# Altium schematic sheet SH08 - OMAP-L137 EMIF A.SchDoc
size 386 x 246 mm
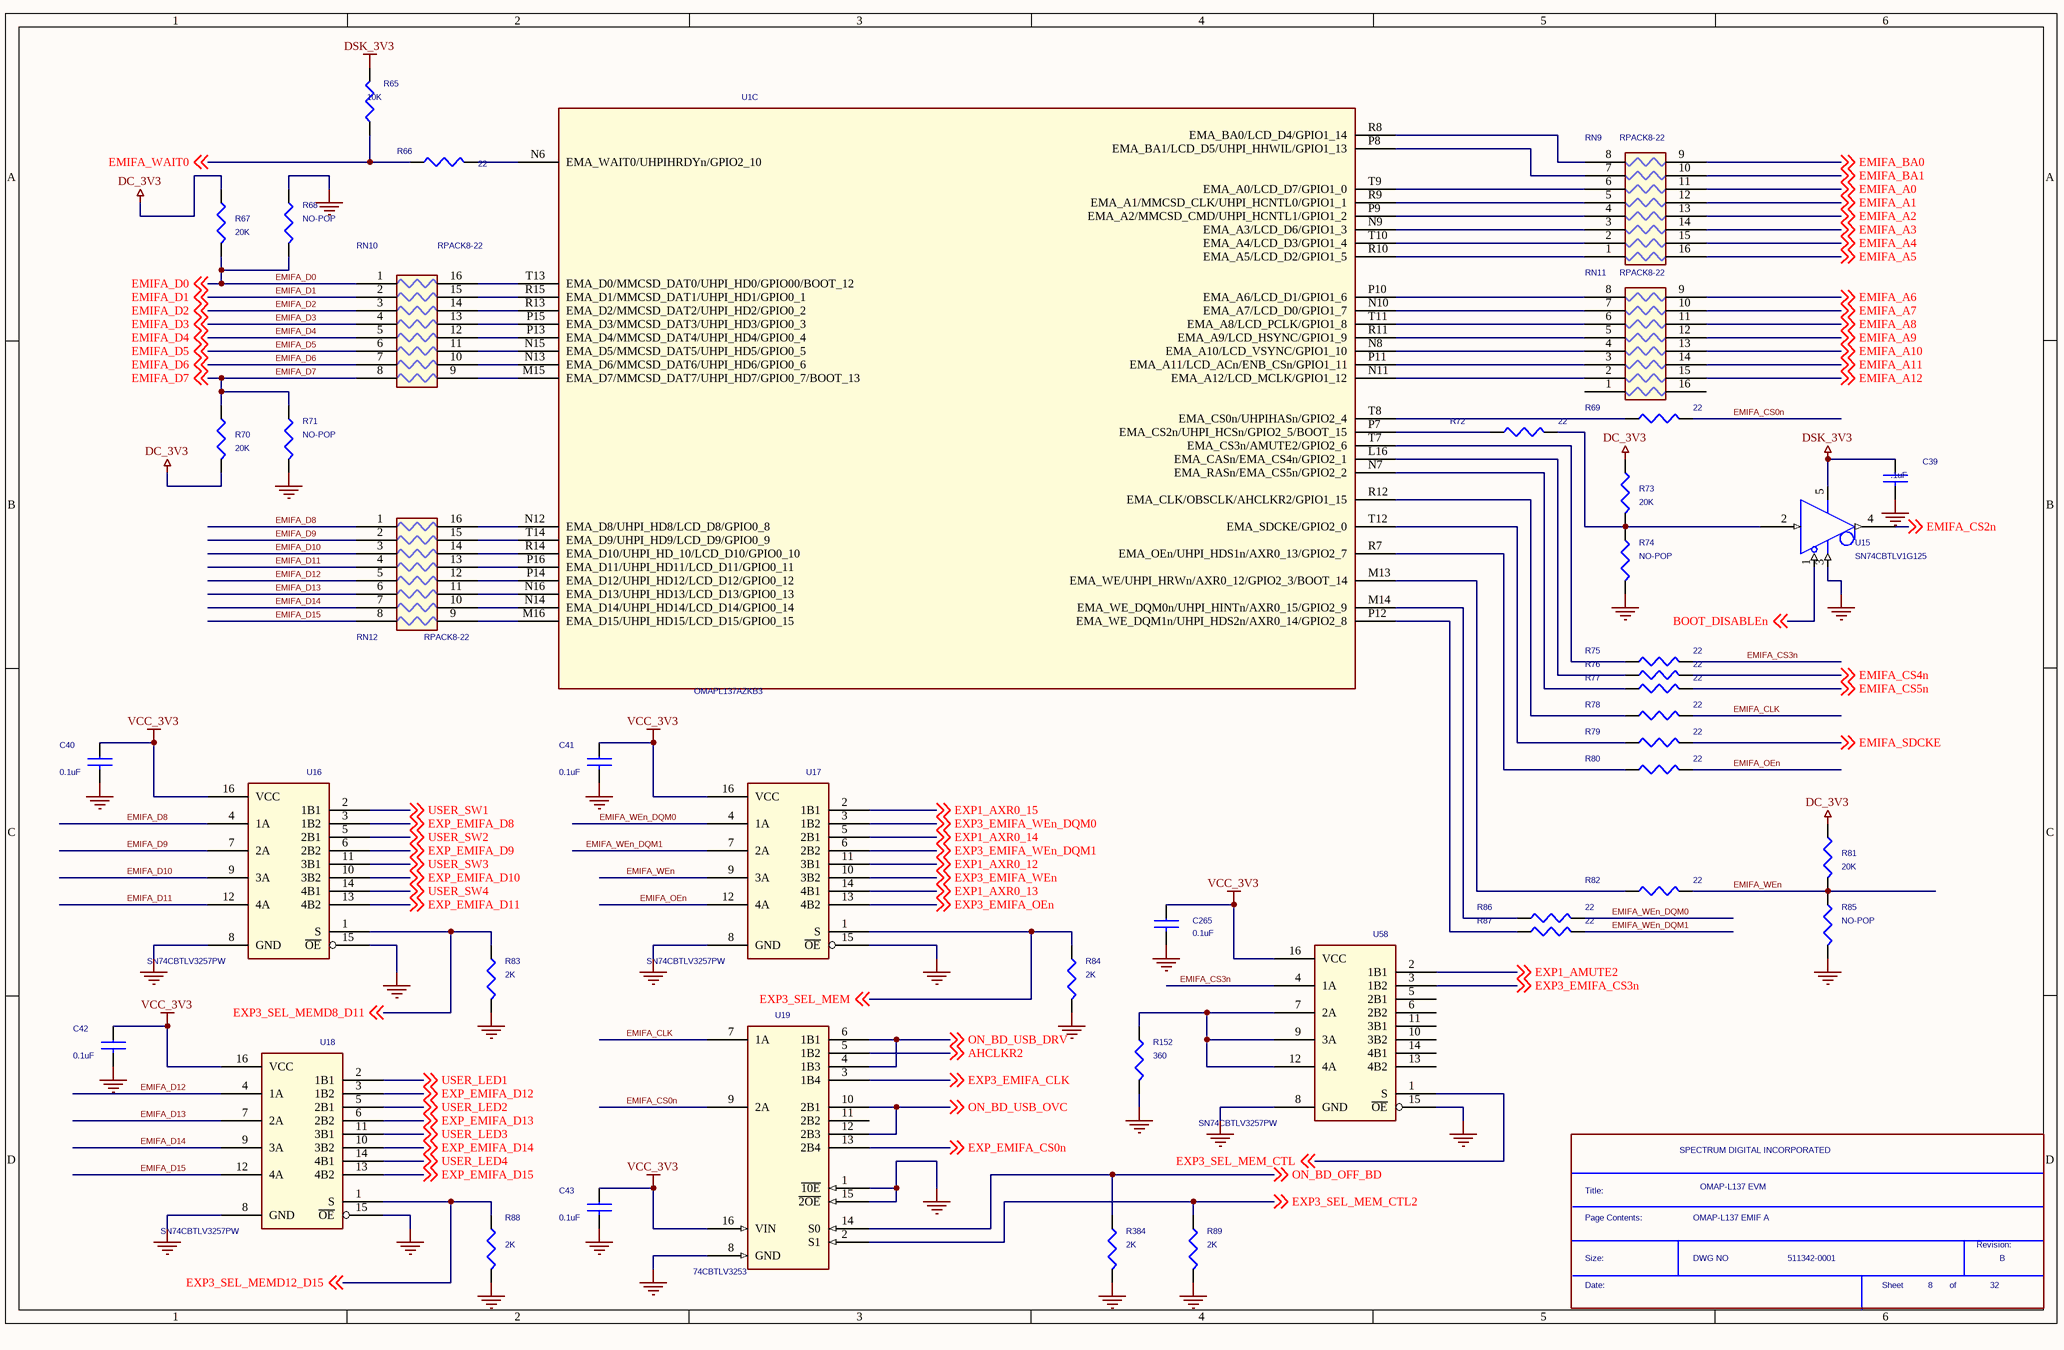
[diagram p0: SH08 - OMAP-L137 EMIF A.SchDoc]

## Parts
*  Page Contents:: OMAP-L137 EMIF A  RevCode: B  Title: OMAP-L137 EVM  OrgName: SPECTRUM DIGITAL INCORPORATED  Doc: 511342-0001  Page Number: 8  Page Count: 32  (hidden comment: SDTitleBlock)  (graphical)
C39  .1uF  [c402-25]
C40  0.1uF  [c402-25]
C41  0.1uF  [c402-25]
C42  0.1uF  [c402-25]
C43  0.1uF  [c402-25]
C265  0.1uF  [c402-25]
R65  10K  [r402-25]
R66  22  [r402-25]
R67  20K  [r402-25]
R68  NO-POP  [r402-25]
R69  22  [r402-25]
R70  20K  [r402-25]
R71  NO-POP  [r402-25]
R72  22  [r402-25]
R73  20K  [r402-25]
R74  NO-POP  [r402-25]
R75  22  [r402-25]
R76  22  [r402-25]
R77  22  [r402-25]
R78  22  [r402-25]
R79  22  [r402-25]
R80  22  [r402-25]
R81  20K  [r402-25]
R82  22  [r402-25]
R83  2K  [r402-25]
R84  2K  [r402-25]
R85  NO-POP  [r402-25]
R86  22  [r402-25]
R87  22  [r402-25]
R88  2K  [r402-25]
R89  2K  [r402-25]
R152  360  [r402-25]
R384  2K  [r402-25]
RN9  RPACK8-22  [rpak16-10x25-2hv]
RN10  RPACK8-22  [rpak16-10x25-2hv]
RN11  RPACK8-22  [rpak16-10x25-2hv]
RN12  RPACK8-22  [rpak16-10x25-2hv]
U1  OMAPL137AZKB3  [skt256-6064]  (part C of 9)
U15  SN74CBTLV1G125  [DCK]
U16  SN74CBTLV3257PW  [TSSOP-16]
U17  SN74CBTLV3257PW  [TSSOP-16]
U18  SN74CBTLV3257PW  [TSSOP-16]
U19  74CBTLV3253  [tssop16-14x70]
U58  SN74CBTLV3257PW  [TSSOP-16]

## Nets
DC_3V3: R67.1 R70.2 R73.1 R81.1
DSK_3V3: C39.1 R65.1 U15.5(VCC)
GND: C39.2 C40.2 C41.2 C42.2 C43.2 C265.2 R68.1 R71.2 R74.2 R83.2 R84.2 R85.2 R88.2 R89.2 R152.2 R384.2 U15.3(GND) U16.8(GND) U16.15(~{OE}) U17.8(GND) U17.15(~{OE}) U18.8(GND) U18.15(~{OE}) U19.1(~{10E}) U19.8(GND) U19.15(~{2OE}) U58.8(GND) U58.15(~{OE})
VCC_3V3: C40.1 C41.1 C42.1 C43.1 C265.1 U16.16(VCC) U17.16(VCC) U18.16(VCC) U19.16(VIN) U58.16(VCC)
AHCLKR2: U19.5(1B2) ; off-sheet AHCLKR2
BOOT_DISABLEn: U15.1(OE) ; off-sheet BOOT_DISABLEn
EMIFA_A0: RN9.11 ; off-sheet EMIFA_A0
EMIFA_A1: RN9.12 ; off-sheet EMIFA_A1
EMIFA_A2: RN9.13 ; off-sheet EMIFA_A2
EMIFA_A3: RN9.14 ; off-sheet EMIFA_A3
EMIFA_A4: RN9.15 ; off-sheet EMIFA_A4
EMIFA_A5: RN9.16 ; off-sheet EMIFA_A5
EMIFA_A6: RN11.9 ; off-sheet EMIFA_A6
EMIFA_A7: RN11.10 ; off-sheet EMIFA_A7
EMIFA_A8: RN11.11 ; off-sheet EMIFA_A8
EMIFA_A9: RN11.12 ; off-sheet EMIFA_A9
EMIFA_A10: RN11.13 ; off-sheet EMIFA_A10
EMIFA_A11: RN11.14 ; off-sheet EMIFA_A11
EMIFA_A12: RN11.15 ; off-sheet EMIFA_A12
EMIFA_BA0: RN9.9 ; off-sheet EMIFA_BA0
EMIFA_BA1: RN9.10 ; off-sheet EMIFA_BA1
EMIFA_CLK: R78.2 U19.7(1A)
EMIFA_CS0n: R69.2 U19.9(2A)
EMIFA_CS2n: U15.4(O) ; off-sheet EMIFA_CS2n
EMIFA_CS3n: R75.2 U58.4(1A)
EMIFA_CS4n: R76.2 ; off-sheet EMIFA_CS4n
EMIFA_CS5n: R77.2 ; off-sheet EMIFA_CS5n
EMIFA_D0: R67.2 R68.2 RN10.1 ; off-sheet EMIFA_D0
EMIFA_D1: RN10.2 ; off-sheet EMIFA_D1
EMIFA_D2: RN10.3 ; off-sheet EMIFA_D2
EMIFA_D3: RN10.4 ; off-sheet EMIFA_D3
EMIFA_D4: RN10.5 ; off-sheet EMIFA_D4
EMIFA_D5: RN10.6 ; off-sheet EMIFA_D5
EMIFA_D6: RN10.7 ; off-sheet EMIFA_D6
EMIFA_D7: R70.1 R71.1 RN10.8 ; off-sheet EMIFA_D7
EMIFA_D8: RN12.1 U16.4(1A)
EMIFA_D9: RN12.2 U16.7(2A)
EMIFA_D10: RN12.3 U16.9(3A)
EMIFA_D11: RN12.4 U16.12(4A)
EMIFA_D12: RN12.5 U18.4(1A)
EMIFA_D13: RN12.6 U18.7(2A)
EMIFA_D14: RN12.7 U18.9(3A)
EMIFA_D15: RN12.8 U18.12(4A)
EMIFA_OEn: R80.2 U17.12(4A)
EMIFA_SDCKE: R79.2 ; off-sheet EMIFA_SDCKE
EMIFA_WAIT0: R65.2 R66.2 ; off-sheet EMIFA_WAIT0
EMIFA_WEn: R81.2 R82.2 R85.1 U17.9(3A)
EMIFA_WEn_DQM0: R86.2 U17.4(1A)
EMIFA_WEn_DQM1: R87.2 U17.7(2A)
EXP1_AMUTE2: U58.2(1B1) ; off-sheet EXP1_AMUTE2
EXP1_AXR0_12: U17.11(3B1) ; off-sheet EXP1_AXR0_12
EXP1_AXR0_13: U17.14(4B1) ; off-sheet EXP1_AXR0_13
EXP1_AXR0_14: U17.5(2B1) ; off-sheet EXP1_AXR0_14
EXP1_AXR0_15: U17.2(1B1) ; off-sheet EXP1_AXR0_15
EXP3_EMIFA_CLK: U19.3(1B4) ; off-sheet EXP3_EMIFA_CLK
EXP3_EMIFA_CS3n: U58.3(1B2) ; off-sheet EXP3_EMIFA_CS3n
EXP3_EMIFA_OEn: U17.13(4B2) ; off-sheet EXP3_EMIFA_OEn
EXP3_EMIFA_WEn: U17.10(3B2) ; off-sheet EXP3_EMIFA_WEn
EXP3_EMIFA_WEn_DQM0: U17.3(1B2) ; off-sheet EXP3_EMIFA_WEn_DQM0
EXP3_EMIFA_WEn_DQM1: U17.6(2B2) ; off-sheet EXP3_EMIFA_WEn_DQM1
EXP3_SEL_MEM: R84.1 U17.1(S) ; off-sheet EXP3_SEL_MEM
EXP3_SEL_MEM_CTL: U58.1(S) ; off-sheet EXP3_SEL_MEM_CTL
EXP3_SEL_MEM_CTL2: R89.1 U19.2(S1) ; off-sheet EXP3_SEL_MEM_CTL2
EXP3_SEL_MEMD8_D11: R83.1 U16.1(S) ; off-sheet EXP3_SEL_MEMD8_D11
EXP3_SEL_MEMD12_D15: R88.1 U18.1(S) ; off-sheet EXP3_SEL_MEMD12_D15
EXP_EMIFA_CS0n: U19.13(2B4) ; off-sheet EXP_EMIFA_CS0n
EXP_EMIFA_D8: U16.3(1B2) ; off-sheet EXP_EMIFA_D8
EXP_EMIFA_D9: U16.6(2B2) ; off-sheet EXP_EMIFA_D9
EXP_EMIFA_D10: U16.10(3B2) ; off-sheet EXP_EMIFA_D10
EXP_EMIFA_D11: U16.13(4B2) ; off-sheet EXP_EMIFA_D11
EXP_EMIFA_D12: U18.3(1B2) ; off-sheet EXP_EMIFA_D12
EXP_EMIFA_D13: U18.6(2B2) ; off-sheet EXP_EMIFA_D13
EXP_EMIFA_D14: U18.10(3B2) ; off-sheet EXP_EMIFA_D14
EXP_EMIFA_D15: U18.13(4B2) ; off-sheet EXP_EMIFA_D15
ON_BD_OFF_BD: R384.1 U19.14(S0) ; off-sheet ON_BD_OFF_BD
ON_BD_USB_DRV: U19.4(1B3) U19.6(1B1) ; off-sheet ON_BD_USB_DRV
ON_BD_USB_OVC: U19.10(2B1) U19.12(2B3) ; off-sheet ON_BD_USB_OVC
USER_LED1: U18.2(1B1) ; off-sheet USER_LED1
USER_LED2: U18.5(2B1) ; off-sheet USER_LED2
USER_LED3: U18.11(3B1) ; off-sheet USER_LED3
USER_LED4: U18.14(4B1) ; off-sheet USER_LED4
USER_SW1: U16.2(1B1) ; off-sheet USER_SW1
USER_SW2: U16.5(2B1) ; off-sheet USER_SW2
USER_SW3: U16.11(3B1) ; off-sheet USER_SW3
USER_SW4: U16.14(4B1) ; off-sheet USER_SW4
NetR66_1: R66.1 U1.N6(EMA_WAIT0/UHPIHRDYn/GPIO2_10)
NetR69_1: R69.1 U1.T8(EMA_CS0n/UHPIHASn/GPIO2_4)
NetR72_1: R72.1 U1.P7(EMA_CS2n/UHPI_HCSn/GPIO2_5/BOOT_15)
NetR72_2: R72.2 R73.2 R74.1 U15.2(I)
NetR75_1: R75.1 U1.T7(EMA_CS3n/AMUTE2/GPIO2_6)
NetR76_1: R76.1 U1.L16(EMA_CASn/EMA_CS4n/GPIO2_1)
NetR77_1: R77.1 U1.N7(EMA_RASn/EMA_CS5n/GPIO2_2)
NetR78_1: R78.1 U1.R12(EMA_CLK/OBSCLK/AHCLKR2/GPIO1_15)
NetR79_1: R79.1 U1.T12(EMA_SDCKE/GPIO2_0)
NetR80_1: R80.1 U1.R7(EMA_OEn/UHPI_HDS1n/AXR0_13/GPIO2_7)
NetR82_1: R82.1 U1.M13(EMA_WE/UHPI_HRWn/AXR0_12/GPIO2_3/BOOT_14)
NetR86_1: R86.1 U1.M14(EMA_WE_DQM0n/UHPI_HINTn/AXR0_15/GPIO2_9)
NetR87_1: R87.1 U1.P12(EMA_WE_DQM1n/UHPI_HDS2n/AXR0_14/GPIO2_8)
NetR152_1: R152.1 U58.7(2A) U58.9(3A) U58.12(4A)
NetRN9_1: RN9.1 U1.R10(EMA_A5/LCD_D2/GPIO1_5)
NetRN9_2: RN9.2 U1.T10(EMA_A4/LCD_D3/GPIO1_4)
NetRN9_3: RN9.3 U1.N9(EMA_A3/LCD_D6/GPIO1_3)
NetRN9_4: RN9.4 U1.P9(EMA_A2/MMCSD_CMD/UHPI_HCNTL1/GPIO1_2)
NetRN9_5: RN9.5 U1.R9(EMA_A1/MMCSD_CLK/UHPI_HCNTL0/GPIO1_1)
NetRN9_6: RN9.6 U1.T9(EMA_A0/LCD_D7/GPIO1_0)
NetRN9_7: RN9.7 U1.P8(EMA_BA1/LCD_D5/UHPI_HHWIL/GPIO1_13)
NetRN9_8: RN9.8 U1.R8(EMA_BA0/LCD_D4/GPIO1_14)
NetRN10_9: RN10.9 U1.M15(EMA_D7/MMCSD_DAT7/UHPI_HD7/GPIO0_7/BOOT_13)
NetRN10_10: RN10.10 U1.N13(EMA_D6/MMCSD_DAT6/UHPI_HD6/GPIO0_6)
NetRN10_11: RN10.11 U1.N15(EMA_D5/MMCSD_DAT5/UHPI_HD5/GPIO0_5)
NetRN10_12: RN10.12 U1.P13(EMA_D4/MMCSD_DAT4/UHPI_HD4/GPIO0_4)
NetRN10_13: RN10.13 U1.P15(EMA_D3/MMCSD_DAT3/UHPI_HD3/GPIO0_3)
NetRN10_14: RN10.14 U1.R13(EMA_D2/MMCSD_DAT2/UHPI_HD2/GPIO0_2)
NetRN10_15: RN10.15 U1.R15(EMA_D1/MMCSD_DAT1/UHPI_HD1/GPIO0_1)
NetRN10_16: RN10.16 U1.T13(EMA_D0/MMCSD_DAT0/UHPI_HD0/GPIO00/BOOT_12)
NetRN11_2: RN11.2 U1.N11(EMA_A12/LCD_MCLK/GPIO1_12)
NetRN11_3: RN11.3 U1.P11(EMA_A11/LCD_ACn/ENB_CSn/GPIO1_11)
NetRN11_4: RN11.4 U1.N8(EMA_A10/LCD_VSYNC/GPIO1_10)
NetRN11_5: RN11.5 U1.R11(EMA_A9/LCD_HSYNC/GPIO1_9)
NetRN11_6: RN11.6 U1.T11(EMA_A8/LCD_PCLK/GPIO1_8)
NetRN11_7: RN11.7 U1.N10(EMA_A7/LCD_D0/GPIO1_7)
NetRN11_8: RN11.8 U1.P10(EMA_A6/LCD_D1/GPIO1_6)
NetRN12_9: RN12.9 U1.M16(EMA_D15/UHPI_HD15/LCD_D15/GPIO0_15)
NetRN12_10: RN12.10 U1.N14(EMA_D14/UHPI_HD14/LCD_D14/GPIO0_14)
NetRN12_11: RN12.11 U1.N16(EMA_D13/UHPI_HD13/LCD_D13/GPIO0_13)
NetRN12_12: RN12.12 U1.P14(EMA_D12/UHPI_HD12/LCD_D12/GPIO0_12)
NetRN12_13: RN12.13 U1.P16(EMA_D11/UHPI_HD11/LCD_D11/GPIO0_11)
NetRN12_14: RN12.14 U1.R14(EMA_D10/UHPI_HD_10/LCD_D10/GPIO0_10)
NetRN12_15: RN12.15 U1.T14(EMA_D9/UHPI_HD9/LCD_D9/GPIO0_9)
NetRN12_16: RN12.16 U1.N12(EMA_D8/UHPI_HD8/LCD_D8/GPIO0_8)

Not connected (* = marked no-connect by the designer): RN11 1 16; U19 11(2B2); U58 5(2B1) 6(2B2) 10(3B2) 11(3B1) 13(4B2) 14(4B1)

## Notes on the sheet
- (in symbol SDTitleBlock) Title:; Page Contents:; Revision:; Size:; DWG NO; Date:; Sheet; of

## Library data of the parts
C39 C265 = CAP NP_2: Part #: 101587-1100R
C40-C43 = CAP NP: Part #: 101587-1100R
R65 = R: Part #: 101370-1003R
R66 R69 R72 R75-R80 R82 R86 R87 = R: Part #: 101370-2200R
R67 R70 R73 R81 = R_1: Part #: 101370-2003R
R68 R71 R74 R85 = R_1: Part #: R0402-NOPOP
R83 R84 R88 R89 R384 = R: Part #: 101370-2002R
R152 = R: Part #: 101370-3601R
RN9-RN12 = RESISTOR DIP 8_0: Part #: 101069-2200R
U1 = PRIMUS_BGA_1: Part #: 102772-0001; SWAP_INFO: (S1+S2+S3+S4+S5+S6+S7+S8+S9); SPLIT_INST: TRUE
U15 = SN74LVC1G125: Part #: 101689-0125R
U16-U18 U58 = SN74CBT3257PW: IC, Quad 2-1 Multiplexer; Part #: 101670-0001R; Mfg: TI
U19 = 74CBTLV253_0: Part #: 101433-0001R